# Altium schematic sheet DAQ_Header.SchDoc
size OrCAD A
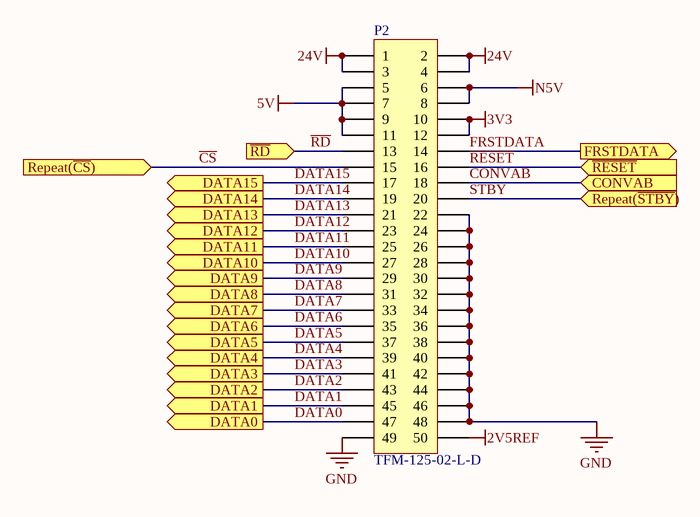
[diagram p0: DAQ_Header.SchDoc]

## Parts
P2  TFM-125-02-L-D  [TFM-125-02-X-D]

## Ports
CONVAB (in), DATA0 (out), DATA1 (out), DATA2 (out), DATA3 (out), DATA4 (out), DATA5 (out), DATA6 (out), DATA7 (out), DATA8 (out), DATA9 (out), DATA10 (out), DATA11 (out), DATA12 (out), DATA13 (out), DATA14 (out), DATA15 (out), FRSTDATA (out), Repeat(~{CS}) (in), Repeat(~{STBY}) (in), ~{RD} (in), ~{RESET} (in)

## Nets
2V5REF: P2.50
3V3: P2.10 P2.12
5V: P2.5 P2.7 P2.9 P2.11
24V: P2.1 P2.2 P2.3 P2.4
GND: P2.22 P2.24 P2.26 P2.28 P2.30 P2.32 P2.34 P2.36 P2.38 P2.40 P2.42 P2.44 P2.46 P2.48 P2.49
N5V: P2.6 P2.8
~{CS}: P2.15 ; port Repeat(~{CS})
CONVAB: P2.18 ; port CONVAB
DATA0: P2.47 ; port DATA0
DATA1: P2.45 ; port DATA1
DATA2: P2.43 ; port DATA2
DATA3: P2.41 ; port DATA3
DATA4: P2.39 ; port DATA4
DATA5: P2.37 ; port DATA5
DATA6: P2.35 ; port DATA6
DATA7: P2.33 ; port DATA7
DATA8: P2.31 ; port DATA8
DATA9: P2.29 ; port DATA9
DATA10: P2.27 ; port DATA10
DATA11: P2.25 ; port DATA11
DATA12: P2.23 ; port DATA12
DATA13: P2.21 ; port DATA13
DATA14: P2.19 ; port DATA14
DATA15: P2.17 ; port DATA15
FRSTDATA: P2.14 ; port FRSTDATA
~{RD}: P2.13 ; port ~{RD}
~{RESET}: P2.16 ; port ~{RESET}
~{STBY}: P2.20 ; port Repeat(~{STBY})

## Library data of the parts
P2 = Header 25X2: Header, 25-Pin, Dual row; LatestRevisionDate: 17-Jul-2002; LatestRevisionNote: Re-released for DXP Platform.; Publisher: Altium Limited; Supplier Part Number 1: TFM-125-02-L-D; Supplier 1: Samtec